# EAGLE schematic Radio-86RK-SRAM (EAGLE 6.3)

## Sheet 1 of 8
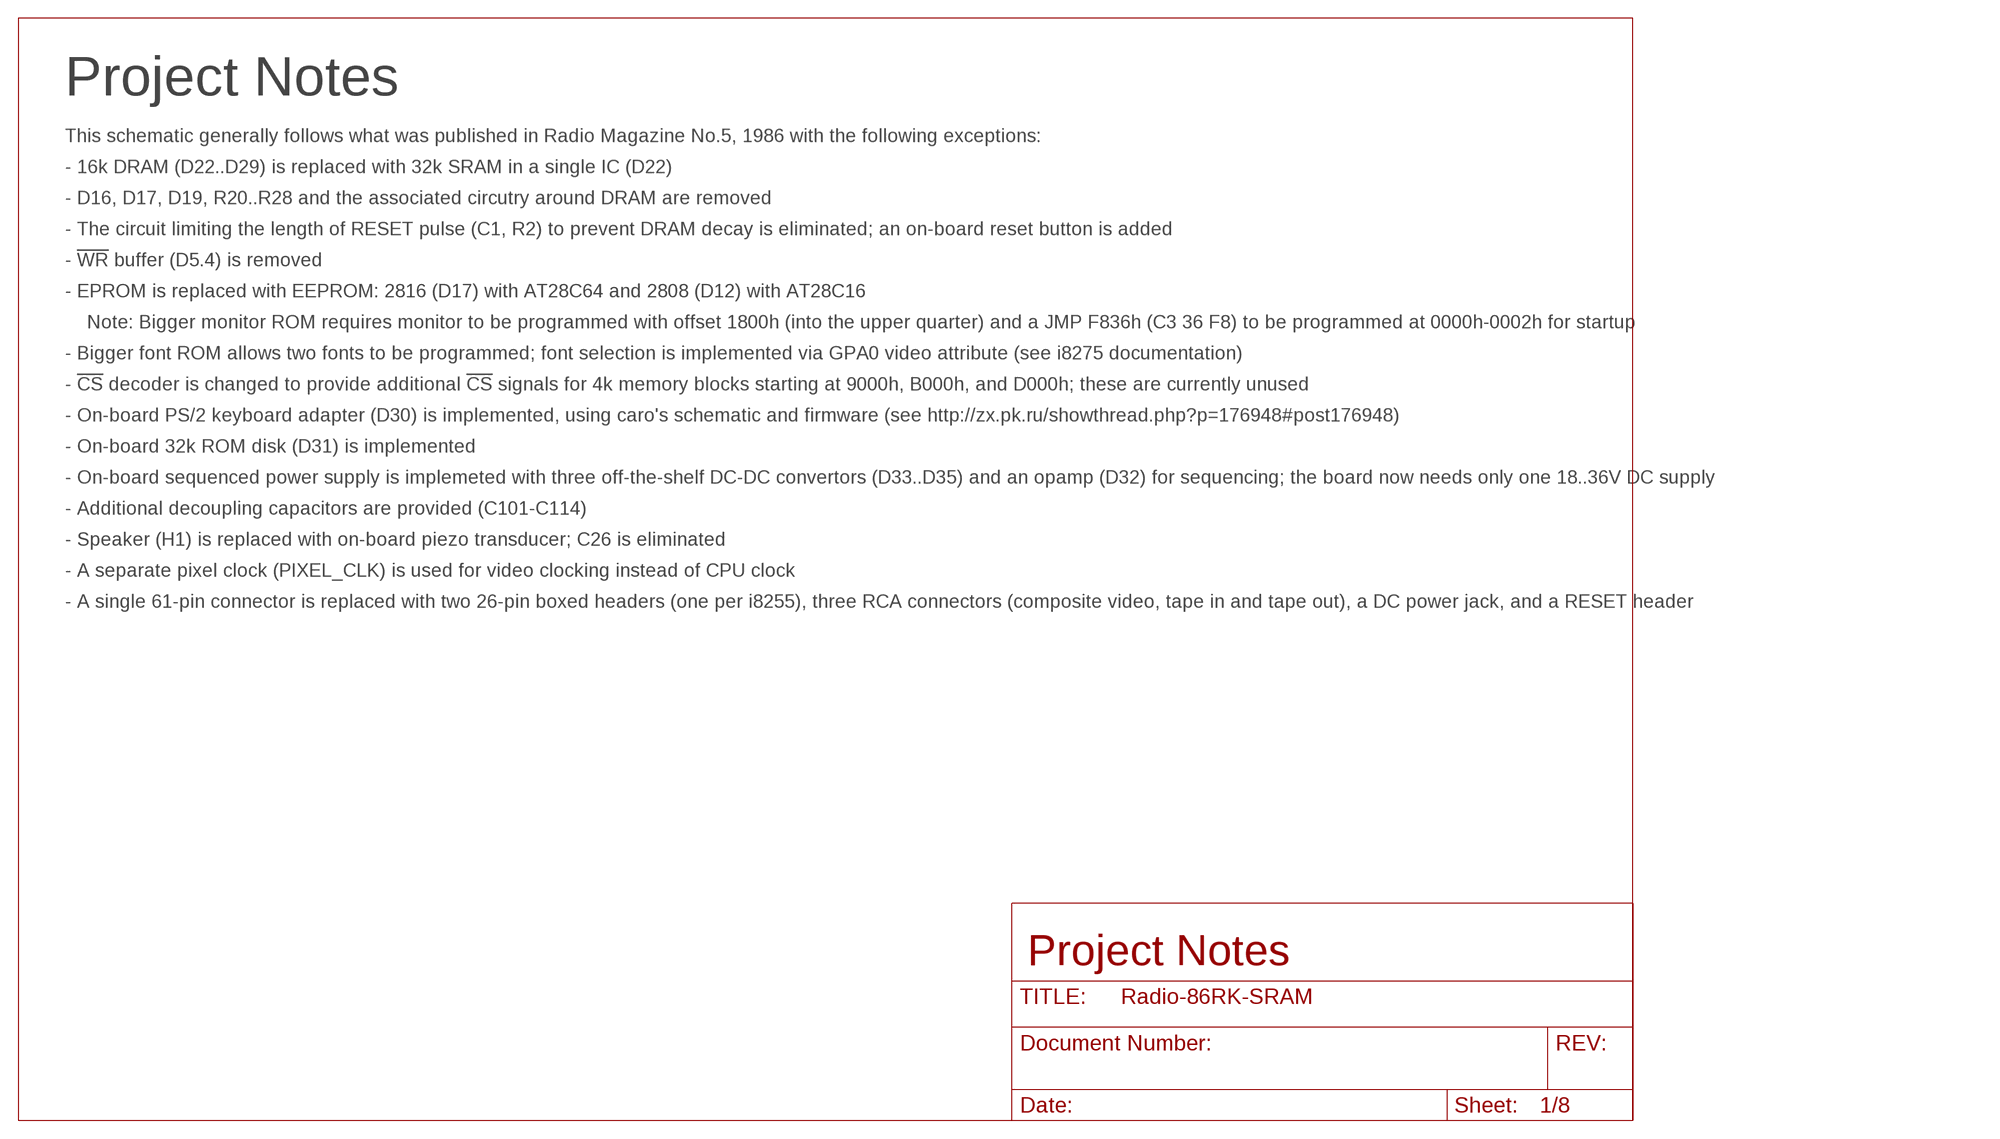
[diagram p0: schematic, sheet 1]

### Notes on the sheet
- Project Notes
- This schematic generally follows what was published in Radio Magazine No.5, 1986 with the following exceptions:
- - 16k DRAM (D22..D29) is replaced with 32k SRAM in a single IC (D22)
- - D16, D17, D19, R20..R28 and the associated circutry around DRAM are removed
- - The circuit limiting the length of RESET pulse (C1, R2) to prevent DRAM decay is eliminated; an on-board reset button is added
- - !WR! buffer (D5.4) is removed
- - EPROM is replaced with EEPROM: 2816 (D17) with AT28C64 and 2808 (D12) with AT28C16
- Note: Bigger monitor ROM requires monitor to be programmed with offset 1800h (into the upper quarter) and a JMP F836h (C3 36 F8) to be programmed at 0000h-0002h for startup
- - Bigger font ROM allows two fonts to be programmed; font selection is implemented via GPA0 video attribute (see i8275 documentation)
- - !CS! decoder is changed to provide additional !CS! signals for 4k memory blocks starting at 9000h, B000h, and D000h; these are currently unused
- - On-board PS/2 keyboard adapter (D30) is implemented, using caro's schematic and firmware (see http://zx.pk.ru/showthread.php?p=176948#post176948)
- - On-board 32k ROM disk (D31) is implemented
- - On-board sequenced power supply is implemeted with three off-the-shelf DC-DC convertors (D33..D35) and an opamp (D32) for sequencing; the board now needs only one 18..36V DC supply
- - Additional decoupling capacitors are provided (C101-C114)
- - Speaker (H1) is replaced with on-board piezo transducer; C26 is eliminated
- - A separate pixel clock (PIXEL_CLK) is used for video clocking instead of CPU clock
- - A single 61-pin connector is replaced with two 26-pin boxed headers (one per i8255), three RCA connectors (composite video, tape in and tape out), a DC power jack, and a RESET header
- Project Notes

## Sheet 2 of 8
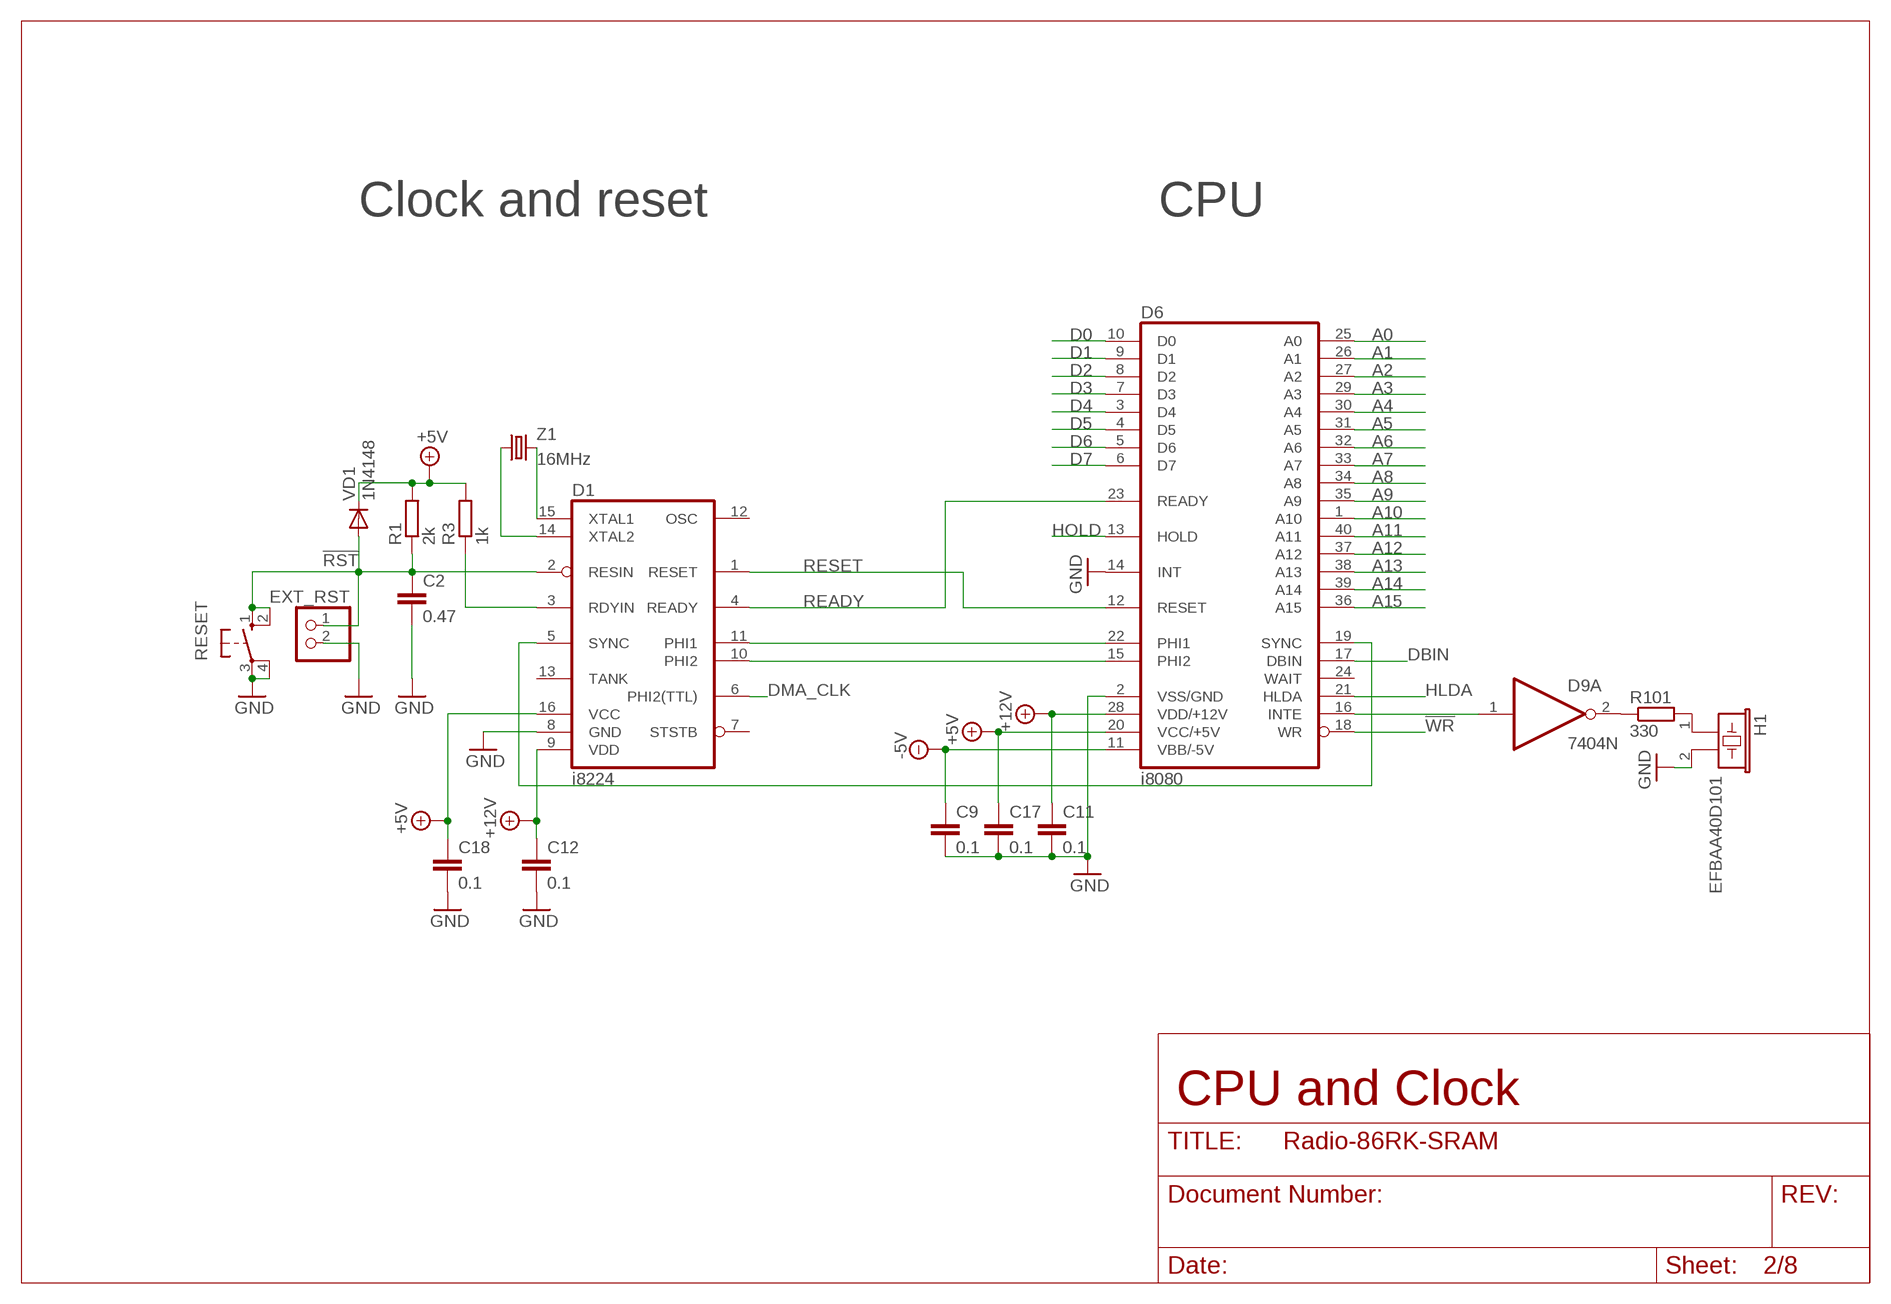
[diagram p1: schematic, sheet 2]

### Parts
C2  0.47  C-EU050-024X044  [C050-024X044]
C9  0.1  C-EU050-024X044  [C050-024X044]
C11  0.1  C-EU050-024X044  [C050-024X044]
C12  0.1  C-EU050-024X044  [C050-024X044]
C17  0.1  C-EU050-024X044  [C050-024X044]
C18  0.1  C-EU050-024X044  [C050-024X044]
D1  i8224  8224  [DIL16]
D6  i8080  8080  [DIL40]
D9  7404N  [DIL14]
EXT_RST  PINHD-1X2  [1X02]
H1  EFBAA40D101  [EFBAA40D101]
R1  2k  R-EU_0207/10  [0207/10]
R3  1k  R-EU_0207/10  [0207/10]
R101  330  R-EU_0207/10  [0207/10]
RESET  10-XX  [B3F-10XX]
VD1  1N4148  1N4148DO35-10  [DO35-10]
Z1  16MHz  CRYSTALHC49U-V  [HC49U-V]

### Nets
!RST: C2.1 D1.2(RESIN) EXT_RST.1 R1.1 RESET.1(S) RESET.2(S1) VD1.A ; also sheet 5
!WR: D6.18(WR) ; also sheet 3,4,7
+5V [power]: C17.1 C18.1 D1.16(VCC) D6.20(VCC/+5V) R1.2 R3.2 VD1.C ; also sheet 3,4,5,6,7,8
+12V [power]: C11.1 C12.1 D1.9(VDD) D6.28(VDD/+12V) ; also sheet 6
-5V [power]: C9.1 D6.11(VBB/-5V) ; also sheet 4,6
A0: D6.25(A0) ; also sheet 3,4,7
A1: D6.26(A1) ; also sheet 4,7
A2: D6.27(A2) ; also sheet 7
A3: D6.29(A3) ; also sheet 7
A4: D6.30(A4) ; also sheet 7
A5: D6.31(A5) ; also sheet 7
A6: D6.32(A6) ; also sheet 7
A7: D6.33(A7) ; also sheet 7
A8: D6.34(A8) ; also sheet 7
A9: D6.35(A9) ; also sheet 7
A10: D6.1(A10) ; also sheet 7
A11: D6.40(A11) ; also sheet 7
A12: D6.37(A12) ; also sheet 7,8
A13: D6.38(A13) ; also sheet 7,8
A14: D6.39(A14) ; also sheet 7,8
A15: D6.36(A15) ; also sheet 7,8
D0: D6.10(D0) ; also sheet 3,4,7
D1: D6.9(D1) ; also sheet 3,4,7
D2: D6.8(D2) ; also sheet 3,4,7
D3: D6.7(D3) ; also sheet 3,4,7
D4: D6.3(D4) ; also sheet 3,4,7
D5: D6.4(D5) ; also sheet 3,4,7
D6: D6.5(D6) ; also sheet 3,4,7
D7: D6.6(D7) ; also sheet 3,4,7
DBIN: D6.17(DBIN) ; also sheet 7,8
DMA_CLK: D1.6(PHI2(TTL)) ; also sheet 7
GND [power]: C2.2 C9.2 C11.2 C12.2 C17.2 C18.2 D1.8(GND) D6.2(VSS/GND) D6.14(INT) EXT_RST.2 H1.2 RESET.3(P) RESET.4(P1) ; also sheet 3,4,5,6,7,8
HLDA: D6.21(HLDA) ; also sheet 7
HOLD: D6.13(HOLD) ; also sheet 7
N$1: D1.11(PHI1) D6.22(PHI1)
N$2: D1.10(PHI2) D6.15(PHI2)
N$3: D1.15(XTAL1) Z1.2
N$4: D1.14(XTAL2) Z1.1
N$5: D1.5(SYNC) D6.19(SYNC)
N$7: D1.3(RDYIN) R3.1
N$11: D6.16(INTE) D9.1(A:I)
N$12: H1.1 R101.2
N$16: D9.2(A:O) R101.1
READY: D1.4(READY) D6.23(READY) ; also sheet 7
RESET: D1.1(RESET) D6.12(RESET) ; also sheet 4,7,8
Unconnected: D1.7(STSTB) D1.12(OSC) D1.13(TANK) D6.24(WAIT)

### Notes on the sheet
- Clock and reset | CPU
- CPU and Clock

## Sheet 3 of 8
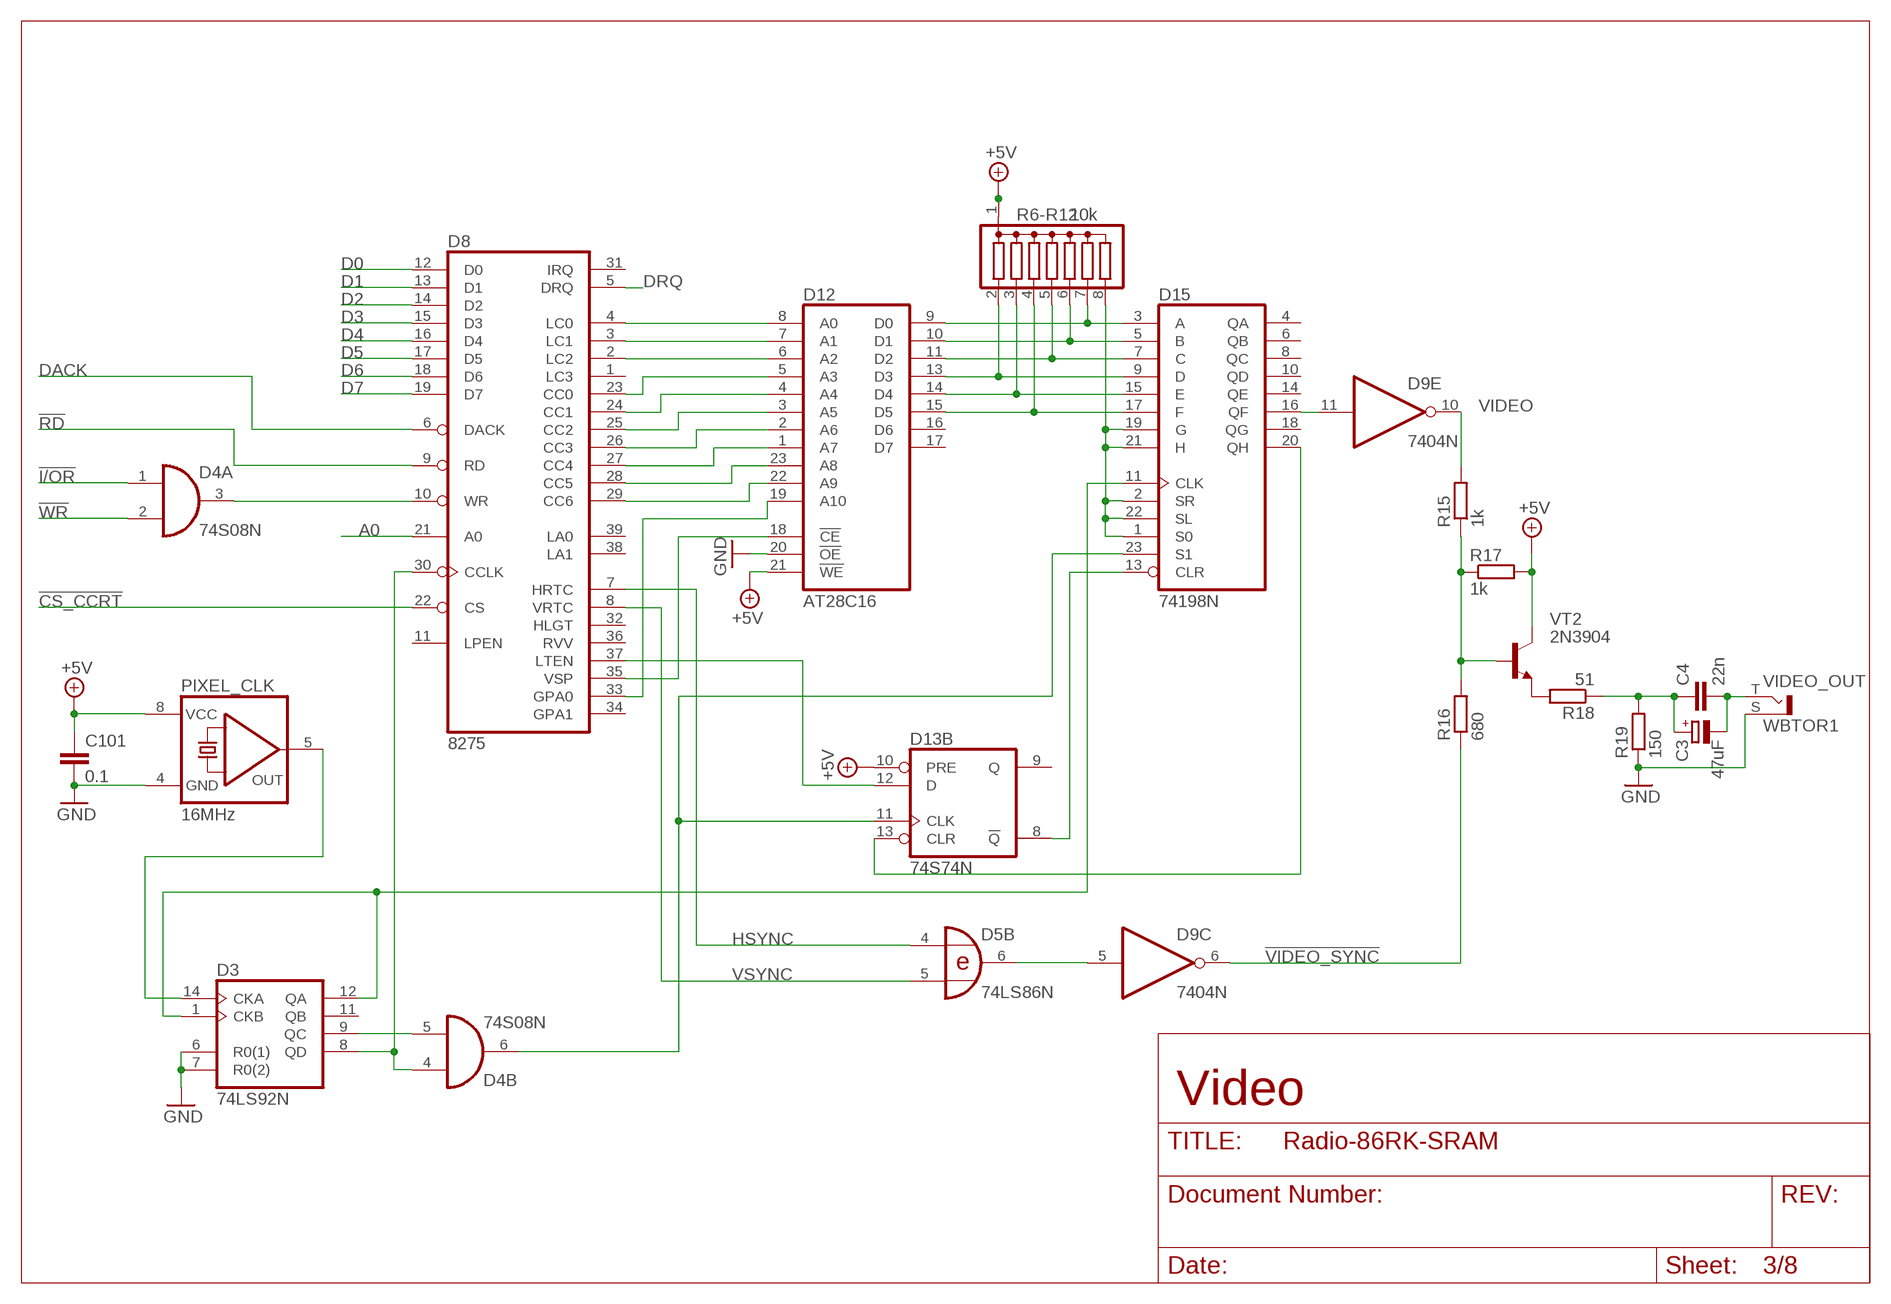
[diagram p2: schematic, sheet 3]

### Parts
C3  47uF  CPOL-EUE2.5-5  [E2,5-5]
C4  22n  C-EU050-024X044  [C050-024X044]
C101  0.1  C-EU050-024X044  [C050-024X044]
D3  74LS92N  [DIL14]
D4  74S08N  [DIL14]
D5  74LS86N  74AC86N  [DIL14]
D8  8275  [DIL40]
D12  AT28C16  2816  [DIL24]
D13  74S74N  [DIL14]
D15  74198N  [DIL24-6]
PIXEL_CLK  16MHz  QG5460  [DIL08S]
R6-R12  10k  G07R  [SIL8]
R15  1k  R-EU_0207/10  [0207/10]
R16  680  R-EU_0207/10  [0207/10]
R17  1k  R-EU_0207/10  [0207/10]
R18  51  R-EU_0207/10  [0207/10]
R19  150  R-EU_0207/10  [0207/10]
VIDEO_OUT  WBTOR1  [WBTOR1]
VT2  2N3904  [TO92]

### Nets
!CS_CCRT: D8.22(CS) ; also sheet 8
!I/OR: D4.1(A:I0) ; also sheet 7,8
!RD: D8.9(RD) ; also sheet 4,7
!VIDEO: D9.11(E:I) D15.16(QF)
!VIDEO_SYNC: D9.6(C:O) R16.1
!WR: D4.2(A:I1) ; also sheet 2,4,7
+5V [power]: C101.1 D12.21(!WE) D13.10(B:PRE) PIXEL_CLK.8(VCC) R6-R12.1 R17.2 VT2.1(C) ; also sheet 2,4,5,6,7,8
A0: D8.21(A0) ; also sheet 2,4,7
COMPOSITE_VIDEO: C3.- C4.2 VIDEO_OUT.T
D0: D8.12(D0) ; also sheet 2,4,7
D1: D8.13(D1) ; also sheet 2,4,7
D2: D8.14(D2) ; also sheet 2,4,7
D3: D8.15(D3) ; also sheet 2,4,7
D4: D8.16(D4) ; also sheet 2,4,7
D5: D8.17(D5) ; also sheet 2,4,7
D6: D8.18(D6) ; also sheet 2,4,7
D7: D8.19(D7) ; also sheet 2,4,7
DACK: D8.6(DACK) ; also sheet 7
DRQ: D8.5(DRQ) ; also sheet 7
GND [power]: C101.2 D3.6(R0(1)) D3.7(R0(2)) D12.20(!OE) PIXEL_CLK.4(GND) R19.1 VIDEO_OUT.S ; also sheet 2,4,5,6,7,8
HSYNC: D5.4(B:I0) D8.7(HRTC)
N$30: D3.14(CKA) PIXEL_CLK.5(OUT)
N$31: D3.1(CKB) D3.12(QA) D15.11(CLK)
N$32: D4.3(A:O) D8.10(WR)
N$33: D3.9(QC) D4.5(B:I1)
N$34: D3.8(QD) D4.4(B:I0) D8.30(CCLK)
N$35: D8.23(CC0) D12.5(A3)
N$36: D8.24(CC1) D12.4(A4)
N$37: D8.25(CC2) D12.3(A5)
N$38: D8.26(CC3) D12.2(A6)
N$39: D8.27(CC4) D12.1(A7)
N$40: D8.4(LC0) D12.8(A0)
N$41: D8.3(LC1) D12.7(A1)
N$42: D8.2(LC2) D12.6(A2)
N$43: D8.35(VSP) D12.18(!CE)
N$44: D12.9(D0) D15.3(A) R6-R12.7
N$45: D8.28(CC5) D12.23(A8)
N$46: D8.29(CC6) D12.22(A9)
N$47: D12.10(D1) D15.5(B) R6-R12.6
N$48: D12.11(D2) D15.7(C) R6-R12.5
N$49: D12.13(D3) D15.9(D) R6-R12.2
N$50: D12.14(D4) D15.15(E) R6-R12.3
N$51: D12.15(D5) D15.17(F) R6-R12.4
N$53: D13.13(B:CLR) D15.20(QH)
N$54: D13.8(B:!Q) D15.13(CLR)
N$55: D4.6(B:O) D13.11(B:CLK) D15.23(S1)
N$56: D8.37(LTEN) D13.12(B:D)
N$57: R15.1 R16.2 R17.1 VT2.2(B)
N$60: D5.6(B:O) D9.5(C:I)
N$63: R18.2 VT2.3(E)
N$64: C3.+ C4.1 R18.1 R19.2
N$105: D8.33(GPA0) D12.19(A10)
N$109 [power]: D15.1(S0) D15.2(SR) D15.19(G) D15.21(H) D15.22(SL) R6-R12.8
VIDEO: D9.10(E:O) R15.2
VSYNC: D5.5(B:I1) D8.8(VRTC)
Unconnected: D3.11(QB) D8.1(LC3) D8.11(LPEN) D8.31(IRQ) D8.32(HLGT) D8.34(GPA1) D8.36(RVV) D8.38(LA1) D8.39(LA0) D12.16(D6) D12.17(D7) D13.9(B:Q) D15.4(QA) D15.6(QB) D15.8(QC) D15.10(QD) D15.14(QE) D15.18(QG)

### Notes on the sheet
- Video

## Sheet 4 of 8
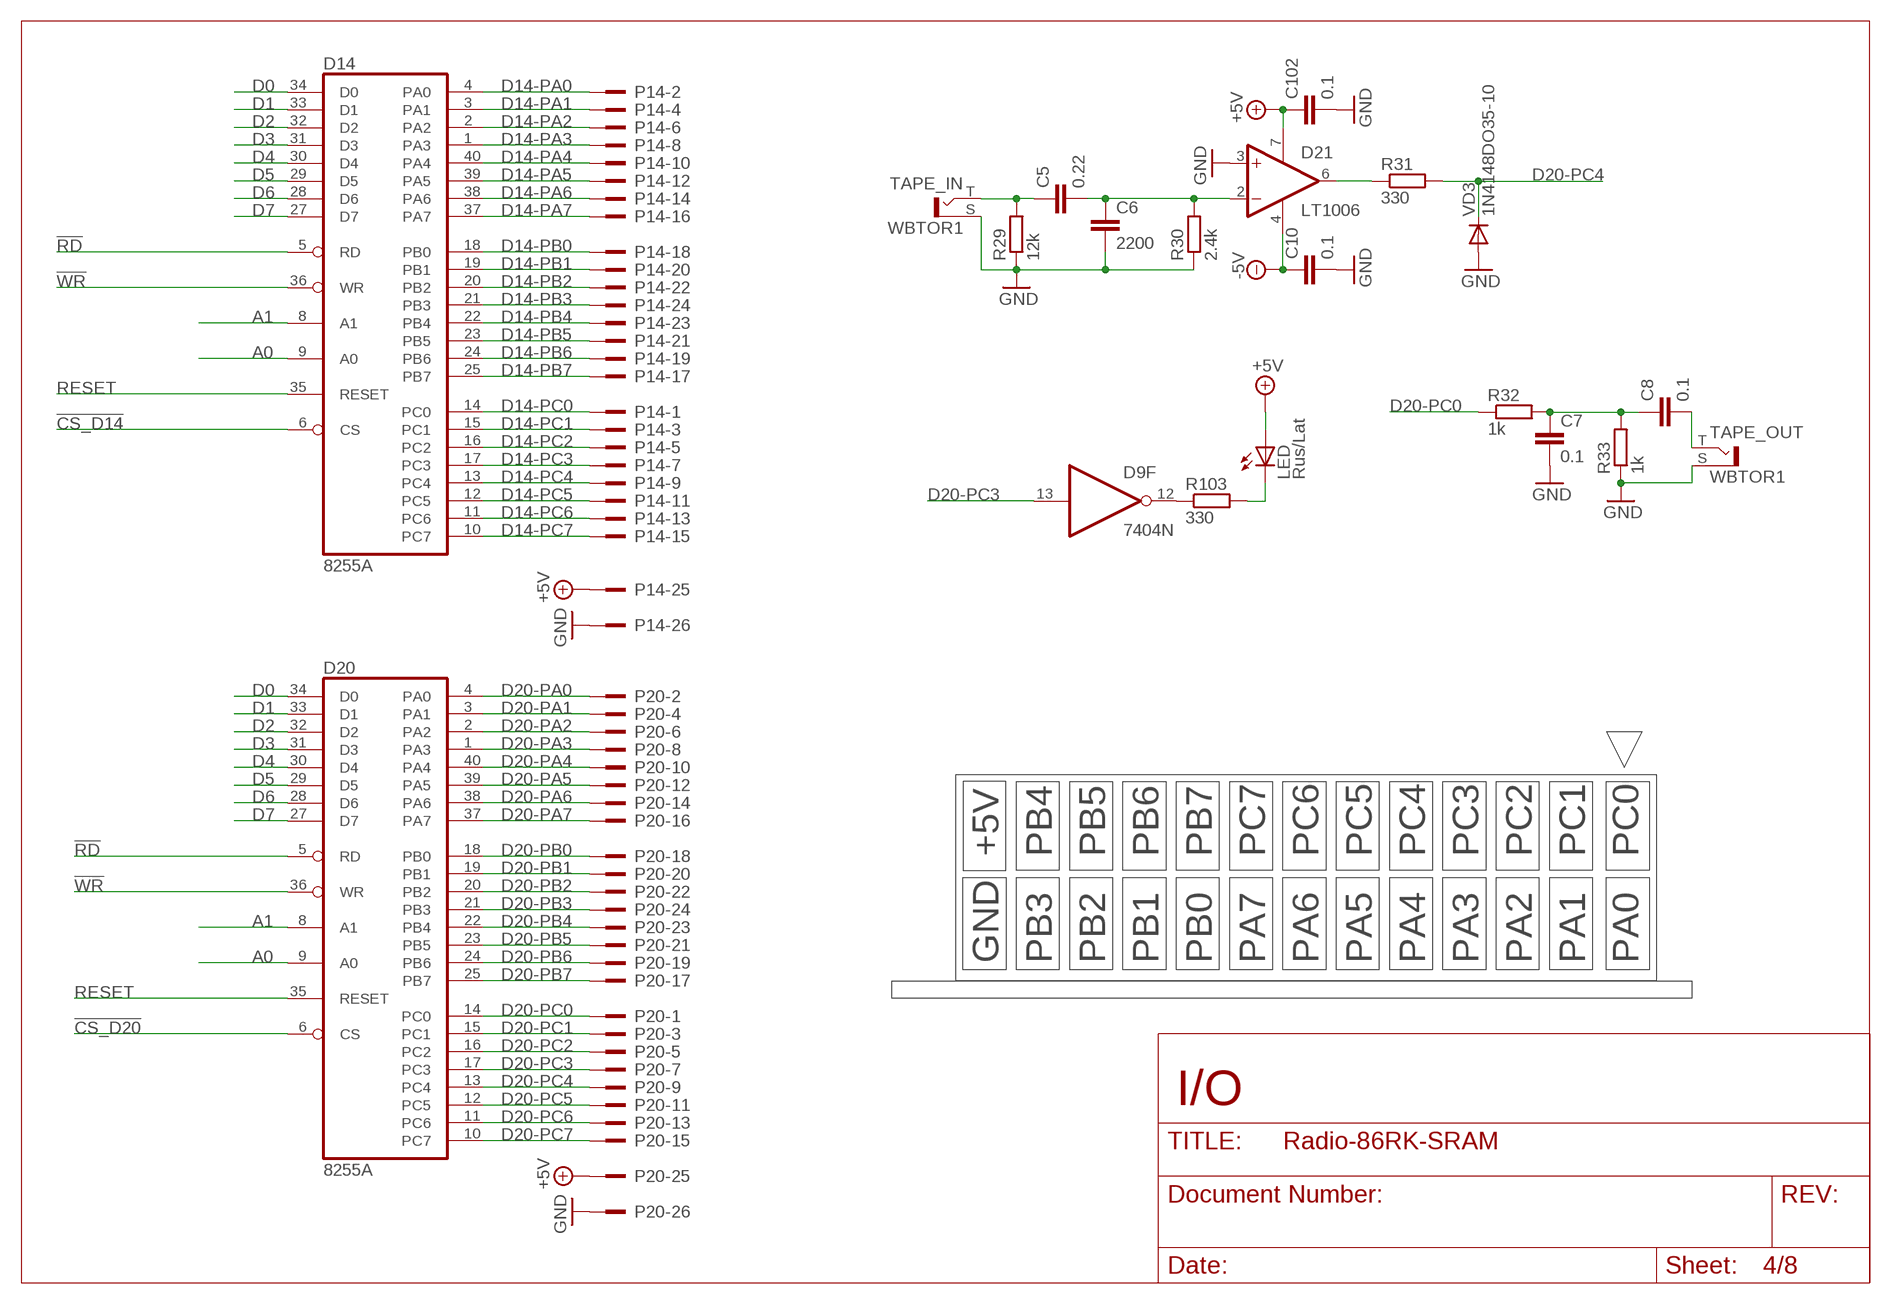
[diagram p3: schematic, sheet 4]

### Parts
C5  0.22  C-EU050-024X044  [C050-024X044]
C6  2200  C-EU050-024X044  [C050-024X044]
C7  0.1  C-EU050-024X044  [C050-024X044]
C8  0.1  C-EU050-024X044  [C050-024X044]
C10  0.1  C-EU050-024X044  [C050-024X044]
C102  0.1  C-EU050-024X044  [C050-024X044]
D14  8255A  [DIL40]
D20  8255A  [DIL40]
D21  LT1006  1AMP_P7+4N  [DIL08]
LED  Rus/Lat  LED3MM  [LED3MM]
P14  2526-5  [PAK100/2500-5-26]
P20  2526-5  [PAK100/2500-5-26]
R29  12k  R-EU_0207/10  [0207/10]
R30  2.4k  R-EU_0207/10  [0207/10]
R31  330  R-EU_0207/10  [0207/10]
R32  1k  R-EU_0207/10  [0207/10]
R33  1k  R-EU_0207/10  [0207/10]
R103  330  R-EU_0207/10  [0207/10]
TAPE_IN  WBTOR1  [WBTOR1]
TAPE_OUT  WBTOR1  [WBTOR1]
VD3  1N4148DO35-10  [DO35-10]

### Nets
!CS_D14: D14.6(CS) ; also sheet 8
!CS_D20: D20.6(CS) ; also sheet 8
!RD: D14.5(RD) D20.5(RD) ; also sheet 3,7
!WR: D14.36(WR) D20.36(WR) ; also sheet 2,3,7
+5V [power]: C102.1 D21.7(V+) LED.A P14.25 P20.25 ; also sheet 2,3,5,6,7,8
-5V [power]: C10.1 D21.4(V-) ; also sheet 2,6
A0: D14.9(A0) D20.9(A0) ; also sheet 2,3,7
A1: D14.8(A1) D20.8(A1) ; also sheet 2,7
D0: D14.34(D0) D20.34(D0) ; also sheet 2,3,7
D1: D14.33(D1) D20.33(D1) ; also sheet 2,3,7
D2: D14.32(D2) D20.32(D2) ; also sheet 2,3,7
D3: D14.31(D3) D20.31(D3) ; also sheet 2,3,7
D4: D14.30(D4) D20.30(D4) ; also sheet 2,3,7
D5: D14.29(D5) D20.29(D5) ; also sheet 2,3,7
D6: D14.28(D6) D20.28(D6) ; also sheet 2,3,7
D7: D14.27(D7) D20.27(D7) ; also sheet 2,3,7
D14-PA0: D14.4(PA0) P14.2 ; also sheet 5
D14-PA1: D14.3(PA1) P14.4 ; also sheet 5
D14-PA2: D14.2(PA2) P14.6 ; also sheet 5
D14-PA3: D14.1(PA3) P14.8 ; also sheet 5
D14-PA4: D14.40(PA4) P14.10 ; also sheet 5
D14-PA5: D14.39(PA5) P14.12 ; also sheet 5
D14-PA6: D14.38(PA6) P14.14 ; also sheet 5
D14-PA7: D14.37(PA7) P14.16 ; also sheet 5
D14-PB0: D14.18(PB0) P14.18 ; also sheet 5
D14-PB1: D14.19(PB1) P14.20 ; also sheet 5
D14-PB2: D14.20(PB2) P14.22 ; also sheet 5
D14-PB3: D14.21(PB3) P14.24 ; also sheet 5
D14-PB4: D14.22(PB4) P14.23 ; also sheet 5
D14-PB5: D14.23(PB5) P14.21 ; also sheet 5
D14-PB6: D14.24(PB6) P14.19 ; also sheet 5
D14-PB7: D14.25(PB7) P14.17 ; also sheet 5
D14-PC0: D14.14(PC0) P14.1 ; also sheet 5
D14-PC1: D14.15(PC1) P14.3 ; also sheet 5
D14-PC2: D14.16(PC2) P14.5 ; also sheet 5
D14-PC3: D14.17(PC3) P14.7 ; also sheet 5
D14-PC4: D14.13(PC4) P14.9 ; also sheet 5
D14-PC5: D14.12(PC5) P14.11 ; also sheet 5
D14-PC6: D14.11(PC6) P14.13 ; also sheet 5
D14-PC7: D14.10(PC7) P14.15 ; also sheet 5
D20-PA0: D20.4(PA0) P20.2 ; also sheet 5
D20-PA1: D20.3(PA1) P20.4 ; also sheet 5
D20-PA2: D20.2(PA2) P20.6 ; also sheet 5
D20-PA3: D20.1(PA3) P20.8 ; also sheet 5
D20-PA4: D20.40(PA4) P20.10 ; also sheet 5
D20-PA5: D20.39(PA5) P20.12 ; also sheet 5
D20-PA6: D20.38(PA6) P20.14 ; also sheet 5
D20-PA7: D20.37(PA7) P20.16 ; also sheet 5
D20-PB0: D20.18(PB0) P20.18 ; also sheet 5
D20-PB1: D20.19(PB1) P20.20 ; also sheet 5
D20-PB2: D20.20(PB2) P20.22 ; also sheet 5
D20-PB3: D20.21(PB3) P20.24 ; also sheet 5
D20-PB4: D20.22(PB4) P20.23 ; also sheet 5
D20-PB5: D20.23(PB5) P20.21 ; also sheet 5
D20-PB6: D20.24(PB6) P20.19 ; also sheet 5
D20-PB7: D20.25(PB7) P20.17 ; also sheet 5
D20-PC0: D20.14(PC0) P20.1 R32.1
D20-PC1: D20.15(PC1) P20.3
D20-PC2: D20.16(PC2) P20.5
D20-PC3: D9.13(F:I) D20.17(PC3) P20.7
D20-PC4: D20.13(PC4) P20.9 R31.2 VD3.C
D20-PC5: D20.12(PC5) P20.11 ; also sheet 5
D20-PC6: D20.11(PC6) P20.13 ; also sheet 5
D20-PC7: D20.10(PC7) P20.15 ; also sheet 5
GND [power]: C6.2 C7.2 C10.2 C102.2 D21.3(+IN) P14.26 P20.26 R29.1 R30.1 R33.1 TAPE_IN.S TAPE_OUT.S VD3.A ; also sheet 2,3,5,6,7,8
N$10: D9.12(F:O) R103.1
N$27: LED.K(C) R103.2
N$62: C5.2 C6.1 D21.2(-IN) R30.2
N$110: C7.1 C8.1 R32.2 R33.2
N$111: D21.6(OUT) R31.1
N$113: C5.1 R29.2 TAPE_IN.T
N$123: C8.2 TAPE_OUT.T
RESET: D14.35(RESET) D20.35(RESET) ; also sheet 2,7,8

### Notes on the sheet
- +5V | PB4 | PB5 | PB6 | PB7 | PC7 | PC6 | PC5 | PC4 | PC3 | PC2 | PC1 | PC0
- GND | PB3 | PB2 | PB1 | PB0 | PA7 | PA6 | PA5 | PA4 | PA3 | PA2 | PA1 | PA0
- I/O

## Sheet 5 of 8
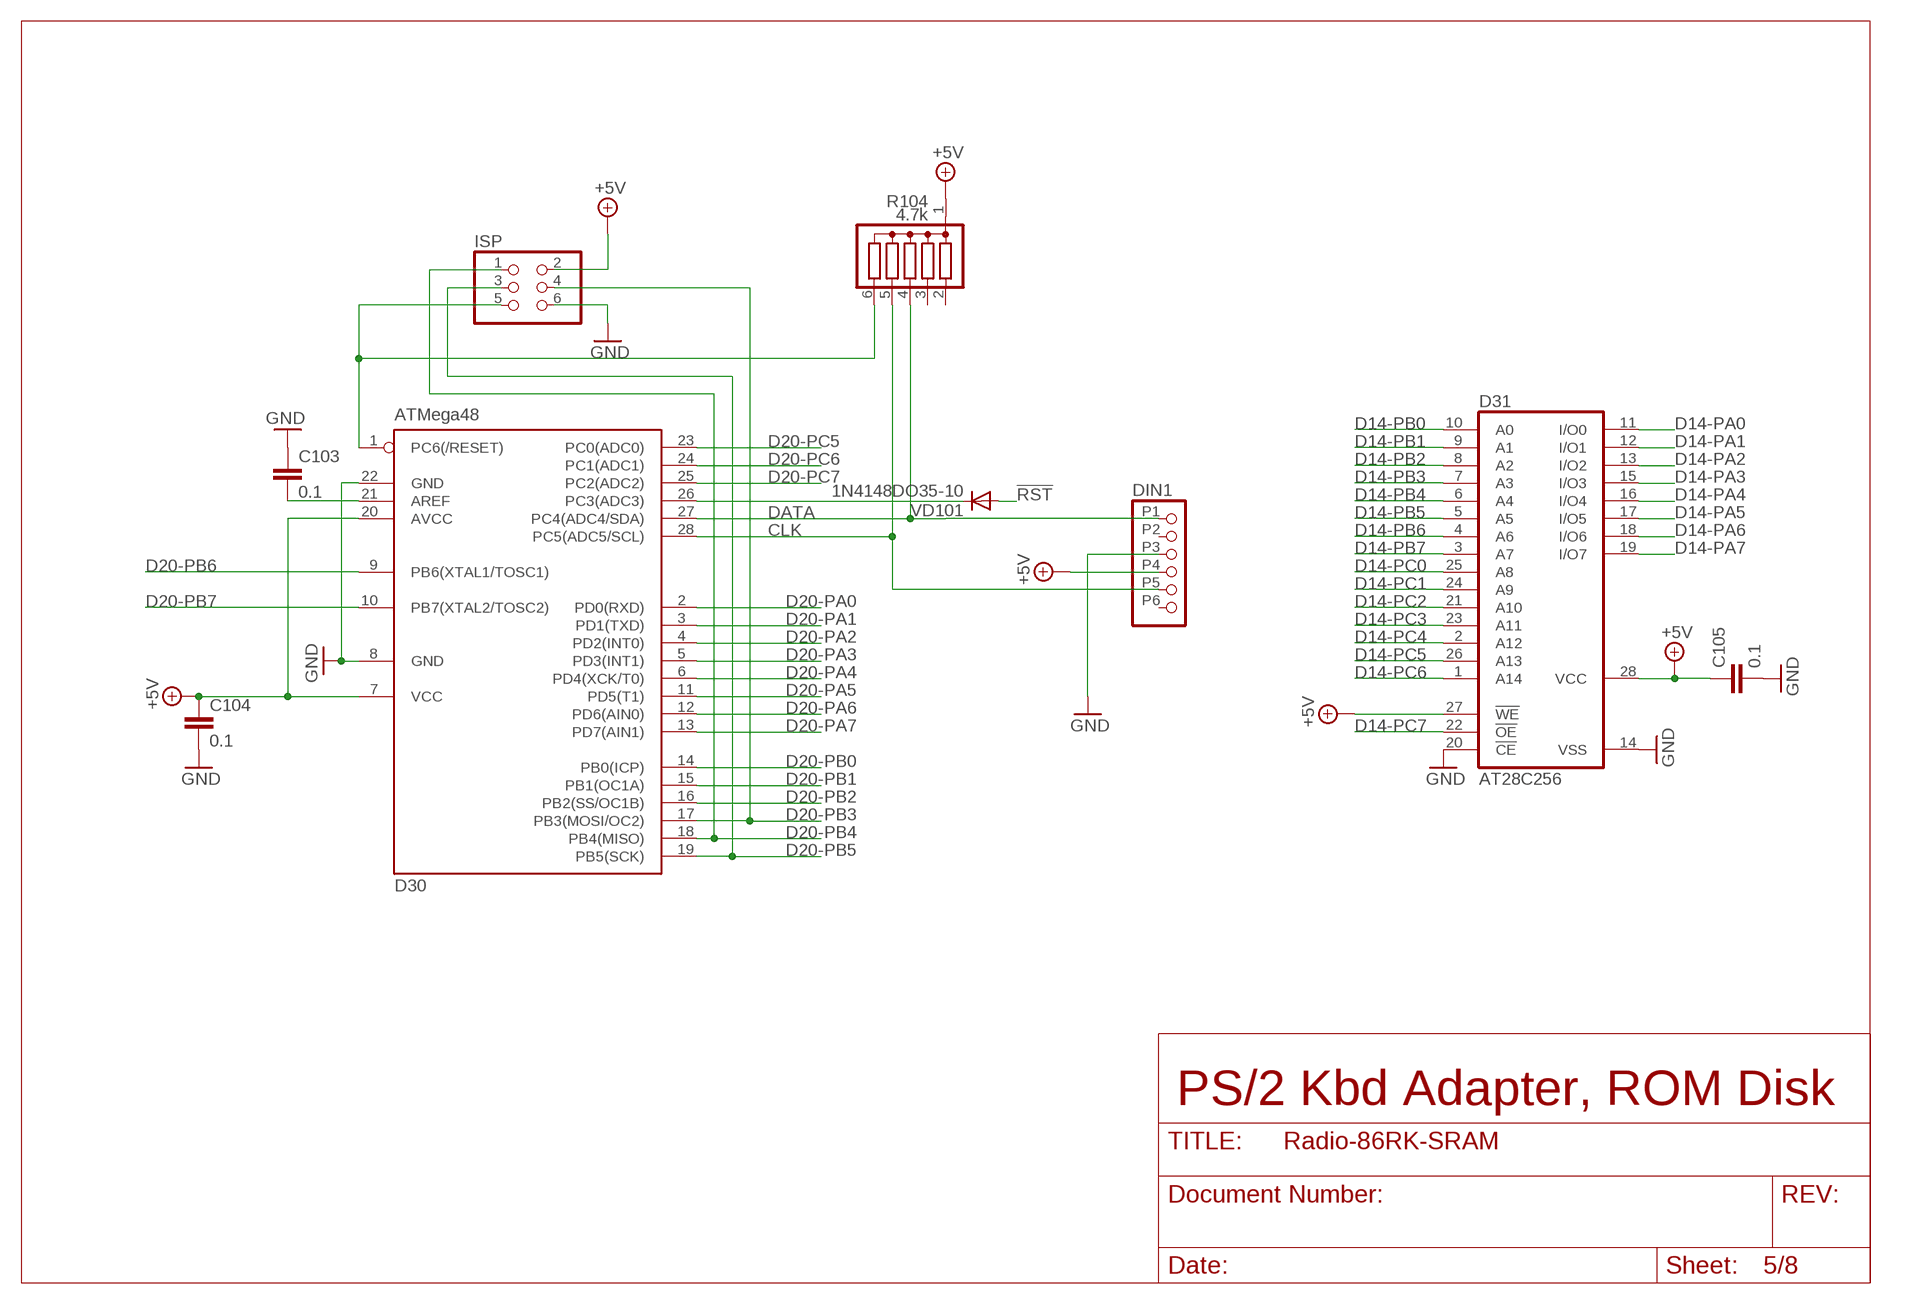
[diagram p4: schematic, sheet 5]

### Parts
C103  0.1  C-EU050-024X044  [C050-024X044]
C104  0.1  C-EU050-024X044  [C050-024X044]
C105  0.1  C-EU050-024X044  [C050-024X044]
D30  ATMega48  MEGA8-P  [DIL28-3]
D31  AT28C256  58C256P  [DIL28-6]
DIN1  TM0508A/6  [MINI-DIN6]
ISP  PINHD-2X3  [2X03]
R104  4.7k  G05R  [SIL6]
VD101  1N4148DO35-10  [DO35-10]

### Nets
!RST: VD101.A ; also sheet 2
+5V [power]: C104.1 C105.1 D30.7(VCC) D30.20(AVCC) D31.27(!WE) D31.28(VCC) DIN1.P4 ISP.2 R104.1 ; also sheet 2,3,4,6,7,8
CLK: D30.28(PC5(ADC5/SCL)) DIN1.P5 R104.5
D14-PA0: D31.11(I/O0) ; also sheet 4
D14-PA1: D31.12(I/O1) ; also sheet 4
D14-PA2: D31.13(I/O2) ; also sheet 4
D14-PA3: D31.15(I/O3) ; also sheet 4
D14-PA4: D31.16(I/O4) ; also sheet 4
D14-PA5: D31.17(I/O5) ; also sheet 4
D14-PA6: D31.18(I/O6) ; also sheet 4
D14-PA7: D31.19(I/O7) ; also sheet 4
D14-PB0: D31.10(A0) ; also sheet 4
D14-PB1: D31.9(A1) ; also sheet 4
D14-PB2: D31.8(A2) ; also sheet 4
D14-PB3: D31.7(A3) ; also sheet 4
D14-PB4: D31.6(A4) ; also sheet 4
D14-PB5: D31.5(A5) ; also sheet 4
D14-PB6: D31.4(A6) ; also sheet 4
D14-PB7: D31.3(A7) ; also sheet 4
D14-PC0: D31.25(A8) ; also sheet 4
D14-PC1: D31.24(A9) ; also sheet 4
D14-PC2: D31.21(A10) ; also sheet 4
D14-PC3: D31.23(A11) ; also sheet 4
D14-PC4: D31.2(A12) ; also sheet 4
D14-PC5: D31.26(A13) ; also sheet 4
D14-PC6: D31.1(A14) ; also sheet 4
D14-PC7: D31.22(!OE) ; also sheet 4
D20-PA0: D30.2(PD0(RXD)) ; also sheet 4
D20-PA1: D30.3(PD1(TXD)) ; also sheet 4
D20-PA2: D30.4(PD2(INT0)) ; also sheet 4
D20-PA3: D30.5(PD3(INT1)) ; also sheet 4
D20-PA4: D30.6(PD4(XCK/T0)) ; also sheet 4
D20-PA5: D30.11(PD5(T1)) ; also sheet 4
D20-PA6: D30.12(PD6(AIN0)) ; also sheet 4
D20-PA7: D30.13(PD7(AIN1)) ; also sheet 4
D20-PB0: D30.14(PB0(ICP)) ; also sheet 4
D20-PB1: D30.15(PB1(OC1A)) ; also sheet 4
D20-PB2: D30.16(PB2(SS/OC1B)) ; also sheet 4
D20-PB3: D30.17(PB3(MOSI/OC2)) ISP.4 ; also sheet 4
D20-PB4: D30.18(PB4(MISO)) ISP.1 ; also sheet 4
D20-PB5: D30.19(PB5(SCK)) ISP.3 ; also sheet 4
D20-PB6: D30.9(PB6(XTAL1/TOSC1)) ; also sheet 4
D20-PB7: D30.10(PB7(XTAL2/TOSC2)) ; also sheet 4
D20-PC5: D30.23(PC0(ADC0)) ; also sheet 4
D20-PC6: D30.24(PC1(ADC1)) ; also sheet 4
D20-PC7: D30.25(PC2(ADC2)) ; also sheet 4
DATA: D30.27(PC4(ADC4/SDA)) DIN1.P1 R104.4
GND [power]: C103.1 C104.2 C105.2 D30.8(GND) D30.22(GND) D31.14(VSS) D31.20(!CE) DIN1.P3 ISP.6 ; also sheet 2,3,4,6,7,8
N$52 [power]: C103.2 D30.21(AREF)
N$115: D30.1(PC6(/RESET)) ISP.5 R104.6
N$130: D30.26(PC3(ADC3)) VD101.C
Unconnected: DIN1.P2 DIN1.P6 R104.2 R104.3

### Notes on the sheet
- PS/2 Kbd Adapter, ROM Disk

## Sheet 6 of 8
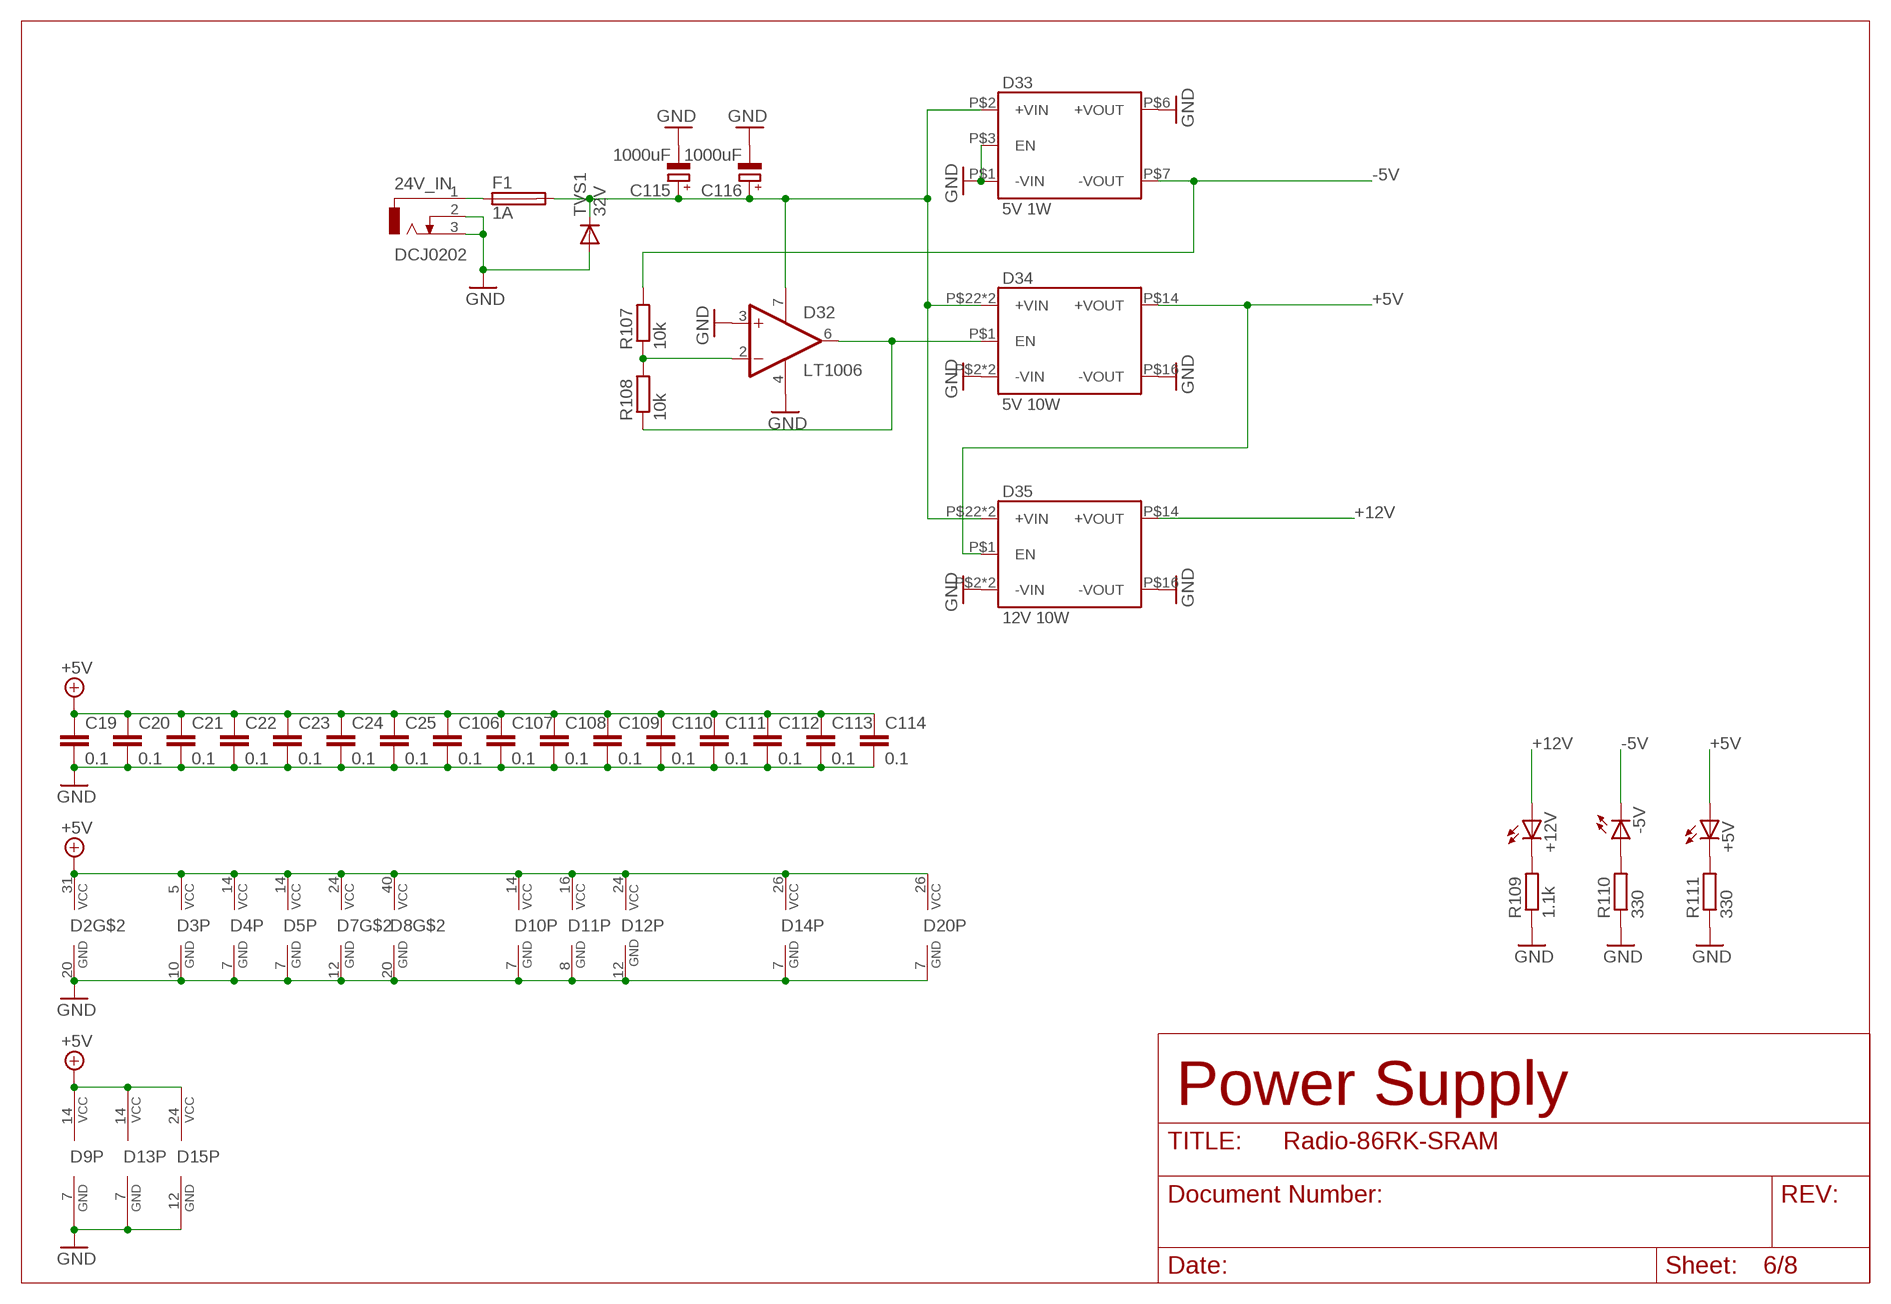
[diagram p5: schematic, sheet 6]

### Parts
24V_IN  DCJ0202  [DCJ0202]
+5V  LED3MM  [LED3MM]
+12V  LED3MM  [LED3MM]
-5V  LED3MM  [LED3MM]
C19  0.1  C-EU050-024X044  [C050-024X044]
C20  0.1  C-EU050-024X044  [C050-024X044]
C21  0.1  C-EU050-024X044  [C050-024X044]
C22  0.1  C-EU050-024X044  [C050-024X044]
C23  0.1  C-EU050-024X044  [C050-024X044]
C24  0.1  C-EU050-024X044  [C050-024X044]
C25  0.1  C-EU050-024X044  [C050-024X044]
C106  0.1  C-EU050-024X044  [C050-024X044]
C107  0.1  C-EU050-024X044  [C050-024X044]
C108  0.1  C-EU050-024X044  [C050-024X044]
C109  0.1  C-EU050-024X044  [C050-024X044]
C110  0.1  C-EU050-024X044  [C050-024X044]
C111  0.1  C-EU050-024X044  [C050-024X044]
C112  0.1  C-EU050-024X044  [C050-024X044]
C113  0.1  C-EU050-024X044  [C050-024X044]
C114  0.1  C-EU050-024X044  [C050-024X044]
C115  1000uF  CPOL-EUE5-13  [E5-13]
C116  1000uF  CPOL-EUE7.5-18  [E7,5-18]
D2  i8257  8257  [DIL40]
D7  8212  [DIL24-6]
D10  74LS00N  74HC00N  [DIL14]
D11  74LS138N  [DIL16]
D32  LT1006  1AMP_P7+4N  [DIL08]
D33  5V 1W  IW_S  [DC/DC_SIP]
D34  5V 10W  JTF_S  [DC/DC_24PIN]
D35  12V 10W  JTF_S  [DC/DC_24PIN]
F1  1A  TE5  [TE5]
R107  10k  R-EU_0207/10  [0207/10]
R108  10k  R-EU_0207/10  [0207/10]
R109  1.1k  R-EU_0207/10  [0207/10]
R110  330  R-EU_0207/10  [0207/10]
R111  330  R-EU_0207/10  [0207/10]
TVS1  32V  DIODE-DO41-10  [DO41-10]

### Nets
+5V [power]: +5V.A C19.1 C20.1 C21.1 C22.1 C23.1 C24.1 C25.1 C106.1 C107.1 C108.1 C109.1 C110.1 C111.1 C112.1 C113.1 C114.1 D2.31(VCC) D3.5(VCC) D4.14(P:VCC) D5.14(P:VCC) D7.24(VCC) D8.40(VCC) D9.14(P:VCC) D10.14(P:VCC) D11.16(VCC) D12.24(VCC) D13.14(P:VCC) D14.26(VCC) D15.24(VCC) D20.26(VCC) D34.P$14(+VOUT) D35.P$1(EN) ; also sheet 2,3,4,5,7,8
+12V [power]: +12V.A D35.P$14(+VOUT) ; also sheet 2
-5V [power]: -5V.K(C) D33.P$7(-VOUT) R107.2 ; also sheet 2,4
GND [power]: 24V_IN.2 24V_IN.3 C19.2 C20.2 C21.2 C22.2 C23.2 C24.2 C25.2 C106.2 C107.2 C108.2 C109.2 C110.2 C111.2 C112.2 C113.2 C114.2 C115.- C116.- D2.20(GND) D3.10(GND) D4.7(P:GND) D5.7(P:GND) D7.12(GND) D8.20(GND) D9.7(P:GND) D10.7(P:GND) D11.8(GND) D12.12(GND) D13.7(P:GND) D14.7(GND) D15.12(GND) D20.7(GND) D32.3(+IN) D32.4(V-) D33.P$1(-VIN) D33.P$3(EN) D33.P$6(+VOUT) D34.P$2(-VIN) D34.P$3(-VIN) D34.P$16(-VOUT) D35.P$2(-VIN) D35.P$3(-VIN) D35.P$16(-VOUT) R109.1 R110.1 R111.1 TVS1.A ; also sheet 2,3,4,5,7,8
N$15: +5V.K(C) R111.2
N$17: +12V.K(C) R109.2
N$18: -5V.A R110.2
N$23 [power]: 24V_IN.1 F1.1
N$28 [power]: C115.+ C116.+ D32.7(V+) D33.P$2(+VIN) D34.P$22(+VIN) D34.P$23(+VIN) D35.P$22(+VIN) D35.P$23(+VIN) F1.2 TVS1.C
N$58: D32.6(OUT) D34.P$1(EN) R108.1
N$59: D32.2(-IN) R107.1 R108.2

### Notes on the sheet
- Power Supply

## Sheet 7 of 8
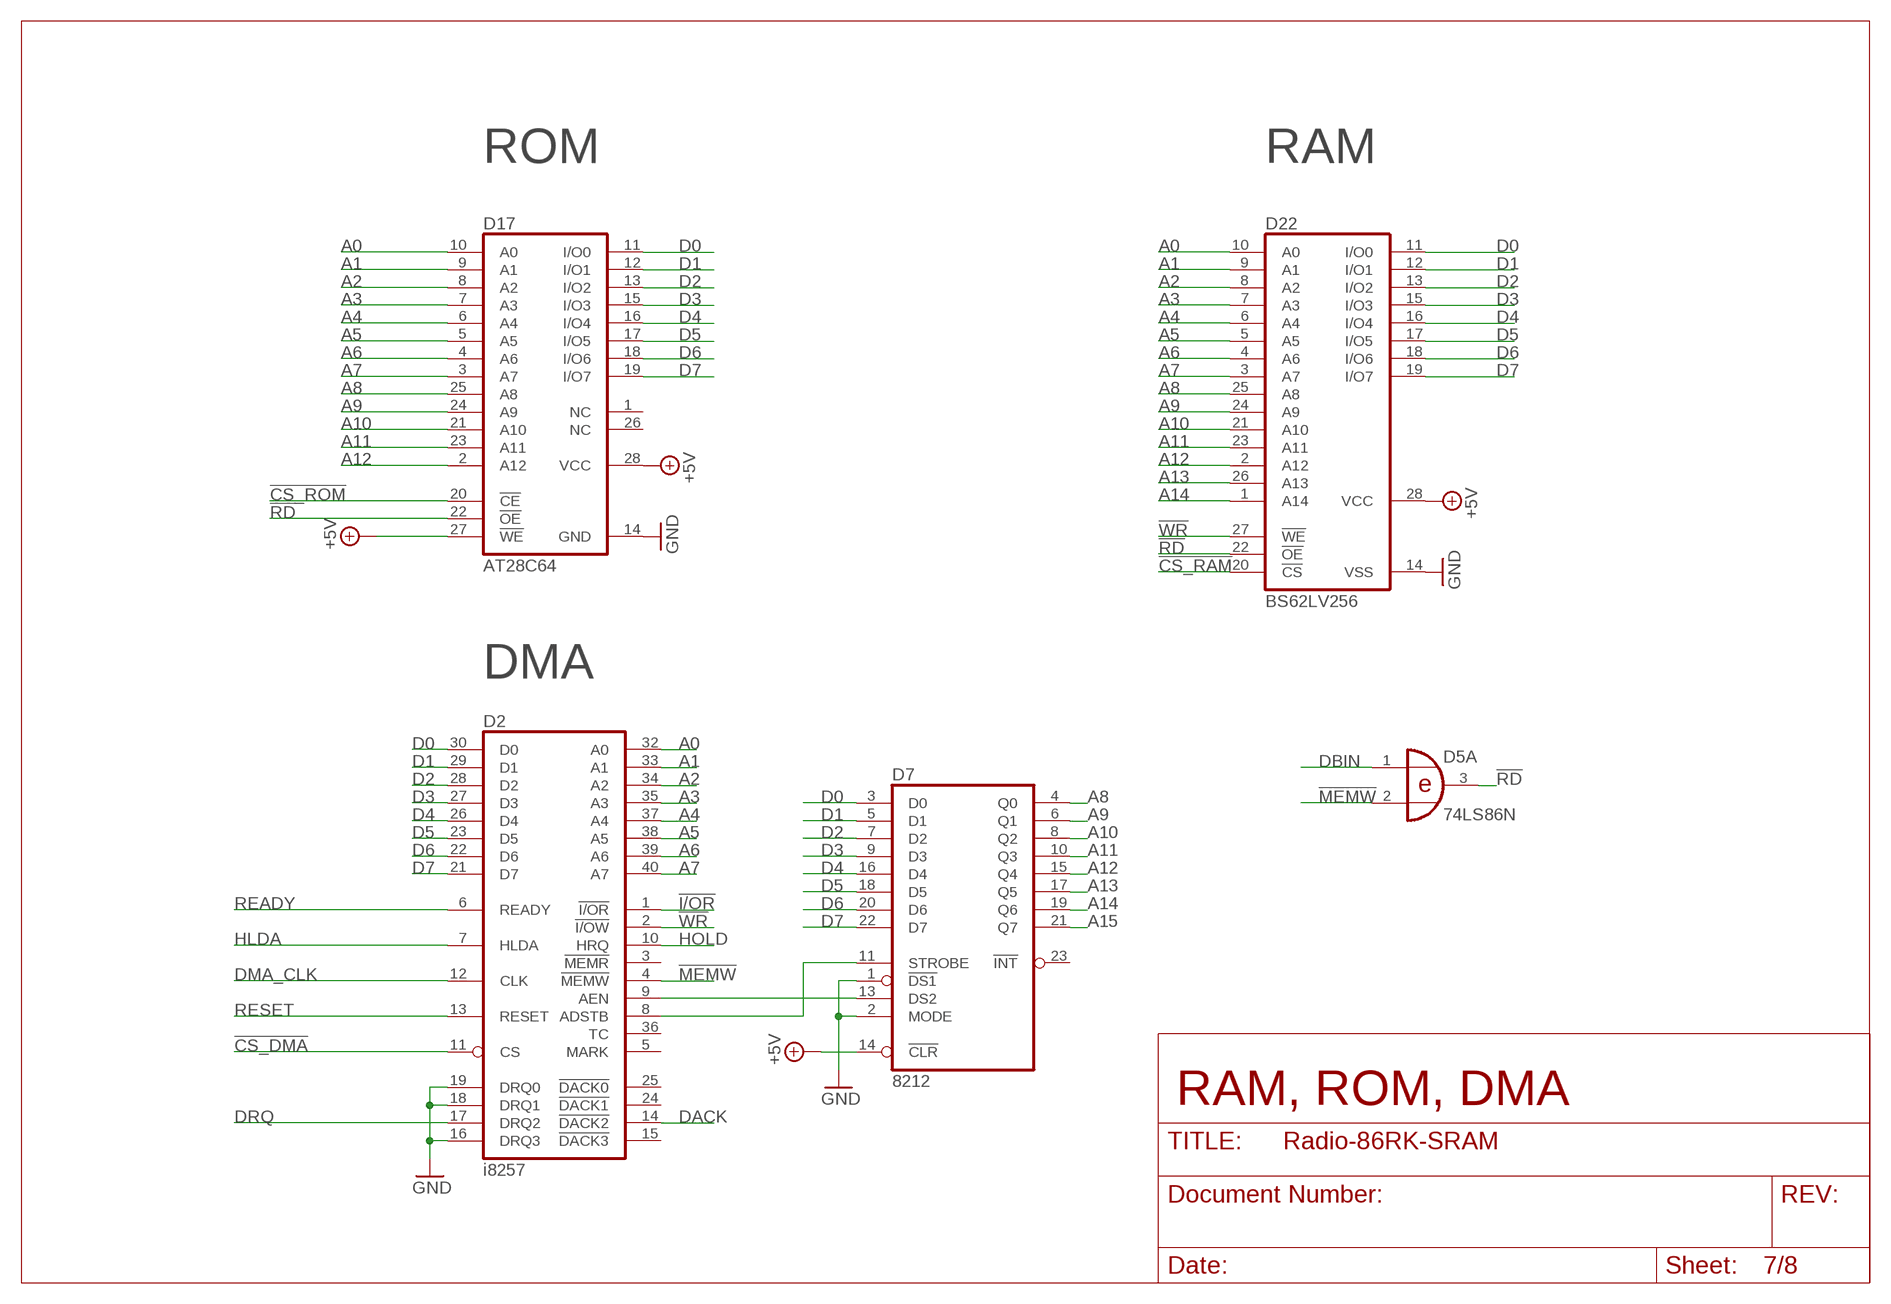
[diagram p6: schematic, sheet 7]

### Parts
D17  AT28C64  28C64C  [DIL28-6]
D22  BS62LV256  62256P  [DIL28-6]

### Nets
!CS_DMA: D2.11(CS) ; also sheet 8
!CS_RAM: D22.20(!CS) ; also sheet 8
!CS_ROM: D17.20(!CE) ; also sheet 8
!I/OR: D2.1(!I/OR) ; also sheet 3,8
!MEMW: D2.4(!MEMW) D5.2(A:I1) ; also sheet 8
!RD: D5.3(A:O) D17.22(!OE) D22.22(!OE) ; also sheet 3,4
!WR: D2.2(!I/OW) D22.27(!WE) ; also sheet 2,3,4
+5V [power]: D7.14(!CLR) D17.27(!WE) D17.28(VCC) D22.28(VCC) ; also sheet 2,3,4,5,6,8
A0: D2.32(A0) D17.10(A0) D22.10(A0) ; also sheet 2,3,4
A1: D2.33(A1) D17.9(A1) D22.9(A1) ; also sheet 2,4
A2: D2.34(A2) D17.8(A2) D22.8(A2) ; also sheet 2
A3: D2.35(A3) D17.7(A3) D22.7(A3) ; also sheet 2
A4: D2.37(A4) D17.6(A4) D22.6(A4) ; also sheet 2
A5: D2.38(A5) D17.5(A5) D22.5(A5) ; also sheet 2
A6: D2.39(A6) D17.4(A6) D22.4(A6) ; also sheet 2
A7: D2.40(A7) D17.3(A7) D22.3(A7) ; also sheet 2
A8: D7.4(Q0) D17.25(A8) D22.25(A8) ; also sheet 2
A9: D7.6(Q1) D17.24(A9) D22.24(A9) ; also sheet 2
A10: D7.8(Q2) D17.21(A10) D22.21(A10) ; also sheet 2
A11: D7.10(Q3) D17.23(A11) D22.23(A11) ; also sheet 2
A12: D7.15(Q4) D17.2(A12) D22.2(A12) ; also sheet 2,8
A13: D7.17(Q5) D22.26(A13) ; also sheet 2,8
A14: D7.19(Q6) D22.1(A14) ; also sheet 2,8
A15: D7.21(Q7) ; also sheet 2,8
D0: D2.30(D0) D7.3(D0) D17.11(I/O0) D22.11(I/O0) ; also sheet 2,3,4
D1: D2.29(D1) D7.5(D1) D17.12(I/O1) D22.12(I/O1) ; also sheet 2,3,4
D2: D2.28(D2) D7.7(D2) D17.13(I/O2) D22.13(I/O2) ; also sheet 2,3,4
D3: D2.27(D3) D7.9(D3) D17.15(I/O3) D22.15(I/O3) ; also sheet 2,3,4
D4: D2.26(D4) D7.16(D4) D17.16(I/O4) D22.16(I/O4) ; also sheet 2,3,4
D5: D2.23(D5) D7.18(D5) D17.17(I/O5) D22.17(I/O5) ; also sheet 2,3,4
D6: D2.22(D6) D7.20(D6) D17.18(I/O6) D22.18(I/O6) ; also sheet 2,3,4
D7: D2.21(D7) D7.22(D7) D17.19(I/O7) D22.19(I/O7) ; also sheet 2,3,4
DACK: D2.14(!DACK2) ; also sheet 3
DBIN: D5.1(A:I0) ; also sheet 2,8
DMA_CLK: D2.12(CLK) ; also sheet 2
DRQ: D2.17(DRQ2) ; also sheet 3
GND [power]: D2.16(DRQ3) D2.18(DRQ1) D2.19(DRQ0) D7.1(!DS1) D7.2(MODE) D17.14(GND) D22.14(VSS) ; also sheet 2,3,4,5,6,8
HLDA: D2.7(HLDA) ; also sheet 2
HOLD: D2.10(HRQ) ; also sheet 2
N$9: D2.8(ADSTB) D7.11(STROBE)
N$14: D2.9(AEN) D7.13(DS2)
READY: D2.6(READY) ; also sheet 2
RESET: D2.13(RESET) ; also sheet 2,4,8
Unconnected: D2.3(!MEMR) D2.5(MARK) D2.15(!DACK3) D2.24(!DACK1) D2.25(!DACK0) D2.36(TC) D7.23(!INT) D17.1(NC) D17.26(NC)

### Notes on the sheet
- ROM | RAM
- DMA
- RAM, ROM, DMA

## Sheet 8 of 8
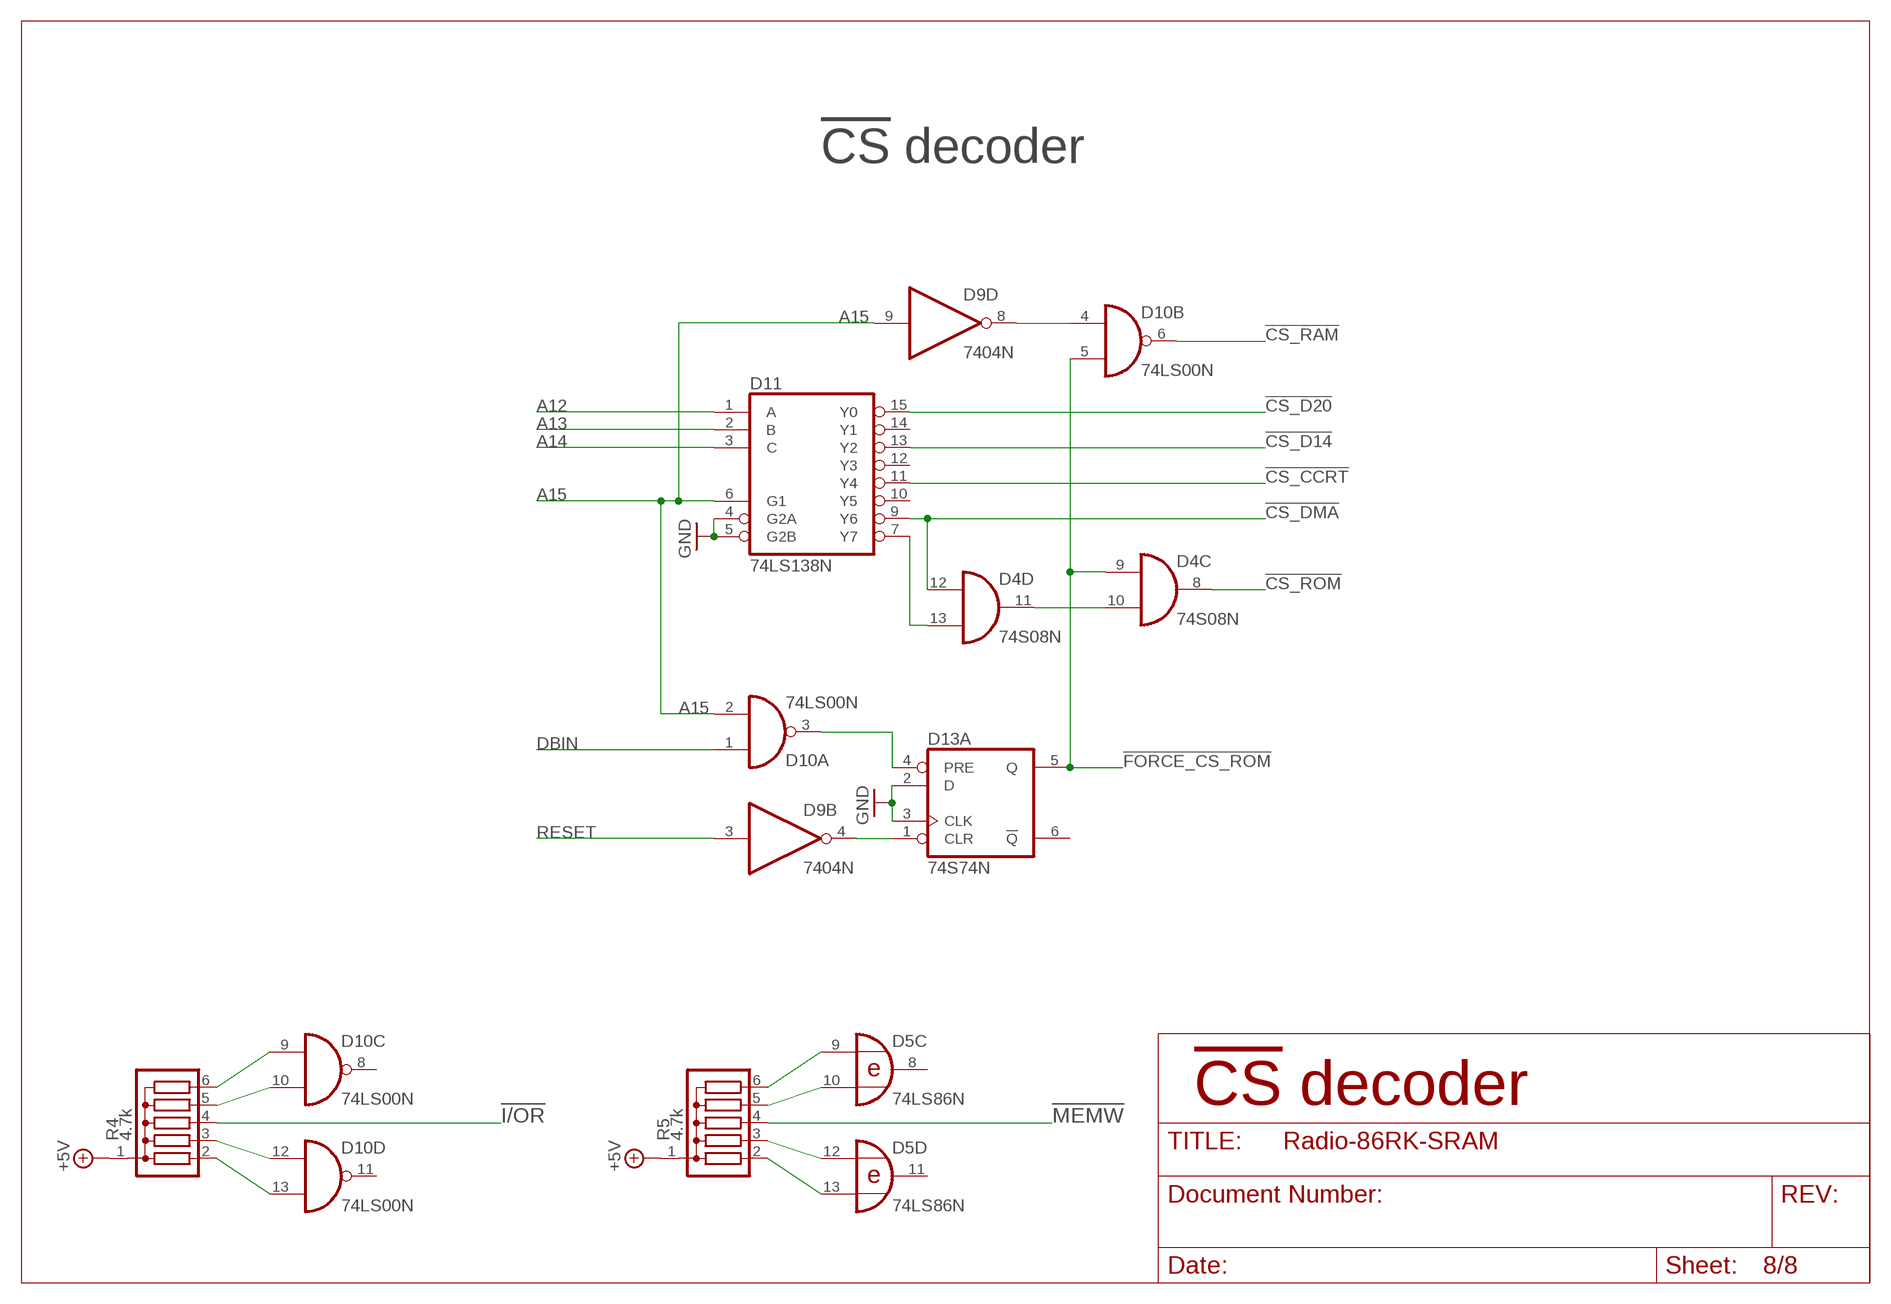
[diagram p7: schematic, sheet 8]

### Parts
R4  4.7k  G05R  [SIL6]
R5  4.7k  G05R  [SIL6]

### Nets
!CS_CCRT: D11.11(Y4) ; also sheet 3
!CS_D14: D11.13(Y2) ; also sheet 4
!CS_D20: D11.15(Y0) ; also sheet 4
!CS_DMA: D4.12(D:I0) D11.9(Y6) ; also sheet 7
!CS_F000: D4.13(D:I1) D11.7(Y7)
!CS_RAM: D10.6(B:O) ; also sheet 7
!CS_ROM: D4.8(C:O) ; also sheet 7
!FORCE_CS_ROM: D4.9(C:I0) D10.5(B:I1) D13.5(A:Q)
!I/OR: R4.4 ; also sheet 3,7
!MEMW: R5.4 ; also sheet 7
+5V [power]: R4.1 R5.1 ; also sheet 2,3,4,5,6,7
A12: D11.1(A) ; also sheet 2,7
A13: D11.2(B) ; also sheet 2,7
A14: D11.3(C) ; also sheet 2,7
A15: D9.9(D:I) D10.2(A:I1) D11.6(G1) ; also sheet 2,7
DBIN: D10.1(A:I0) ; also sheet 2,7
GND [power]: D11.4(G2A) D11.5(G2B) D13.2(A:D) D13.3(A:CLK) ; also sheet 2,3,4,5,6,7
N$6: D10.3(A:O) D13.4(A:PRE)
N$8: D9.4(B:O) D13.1(A:CLR)
N$13: D4.10(C:I1) D4.11(D:O)
N$19: D9.8(D:O) D10.4(B:I0)
N$20: D10.13(D:I1) R4.2
N$21: D10.12(D:I0) R4.3
N$22: D10.10(C:I1) R4.5
N$24: D10.9(C:I0) R4.6
N$25: D5.13(D:I1) R5.2
N$26: D5.12(D:I0) R5.3
N$29: D5.10(C:I1) R5.5
N$61: D5.9(C:I0) R5.6
RESET: D9.3(B:I) ; also sheet 2,4,7
Unconnected: D5.8(C:O) D5.11(D:O) D10.8(C:O) D10.11(D:O) D11.10(Y5) D11.12(Y3) D11.14(Y1) D13.6(A:!Q)

### Notes on the sheet
- !CS! decoder
- !CS! decoder

## Power pins joined to a net without a drawn wire
GND: DIN1.G1(GND) DIN1.G2(GND) DIN1.G3(GND)

## Library data of the parts
24V_IN = con-jack:DCJ0202: DC POWER JACK Source: DCJ0202.pdf; OC_FARNELL: unknown; OC_NEWARK: unknown
+5V +12V -5V LED = led:LED: LED OSRAM: - CHIPLED LG R971, LG N971, LY N971, LG Q971, LY Q971, LO R971, LY R971 LH N974, LH R974 LS Q976, LO Q976, LY Q976 LO Q996 - Hyper CHIPLED LW Q18S LB Q993, LB Q99A, LB R99A - SideLED LS A670, LO A670, LY A670, LG A670, LP A670 LB A673, LV A673, LT A673, LW A673 LH A674 LY A675 LS A676, LA A676, LO A676, LY A676, LW A676 LS A679, LY A679, LG A679 - Hyper Micro SIDELED® LS Y876, LA Y876, LO Y876, LY Y876 LT Y87S - SmartLED LW L88C, LW L88S LB L89C, LB L89S, LG L890 LS L89K, LO L89K, LY L89K LS L896, LA L896, LO L896, LY L896 - TOPLED LS T670, LO T670, LY T670, LG T670, LP T670 LSG T670, LSP T670, LSY T670, LOP T670, LYG T670 LG T671, LOG T671, LSG T671 LB T673, LV T673, LT T673, LW T673 LH T674 LS T676, LA T676, LO T676, LY T676, LB T676, LH T676, LSB T676, LW T676 LB T67C, LV T67C, LT T67C, LS T67K, LO T67K, LY T67K, LW E67C LS E67B, LA E67B, LO E67B, LY E67B, LB E67C, LV E67C, LT E67C LW T67C LS T679, LY T679, LG T679 LS T770, LO T770, LY T770, LG T770, LP T770 LB T773, LV T773, LT T773, LW T773 LH T774 LS E675, LA E675, LY E675, LS T675 LS T776, LA T776, LO T776, LY T776, LB T776 LHGB T686 LT T68C, LB T68C - Hyper Mini TOPLED® LB M676 - Mini TOPLED Santana® LG M470 LS M47K, LO M47K, LY M47K Source: http://www.osram.convergy.de LUXEON: - LUMILED® LXK2-PW12-R00, LXK2-PW12-S00, LXK2-PW14-U00, LXK2-PW14-V00 LXK2-PM12-R00, LXK2-PM12-S00, LXK2-PM14-U00 LXK2-PE12-Q00, LXK2-PE12-R00, LXK2-PE12-S00, LXK2-PE14-T00, LXK2-PE14-U00 LXK2-PB12-K00, LXK2-PB12-L00, LXK2-PB12-M00, LXK2-PB14-N00, LXK2-PB14-P00, LXK2-PB14-Q00 LXK2-PR12-L00, LXK2-PR12-M00, LXK2-PR14-Q00, LXK2-PR14-R00 LXK2-PD12-Q00, LXK2-PD12-R00, LXK2-PD12-S00 LXK2-PH12-R00, LXK2-PH12-S00 LXK2-PL12-P00, LXK2-PL12-Q00, LXK2-PL12-R00 Source: www.luxeon.com KINGBRIGHT: KA-3528ASYC Source: www.kingbright.com
C2 C4-C12 C17-C25 C101-C114 = rcl:C-EU: CAPACITOR, European symbol
C3 C115 C116 = rcl:CPOL-EU: POLARIZED CAPACITOR, European symbol
D1 = micro-intel:8224: MICROCOMPUTER/PERIPHERAL DEVICE; OC_FARNELL: unknown; OC_NEWARK: unknown
D2 = 8080:8257: Programmable DMA controller
D3 = 74xx-eu:74*92: Decade, divide by twelve and binary COUNTER
D4 = 74xx-eu:74*08: Quad 2-input AND gate
D5 = 74xx-eu:74*86: Quad 2-input EXCLUSIVE-OR (XOR) gate
D6 = micro-intel:8080: MICROCOMPUTER/PERIPHERAL DEVICE; OC_FARNELL: unknown; OC_NEWARK: unknown
D7 = 8080:8212: 8-bit Input/Output Port
D8 = 8080:8275: Programmable CRT Controller
D9 = 74xx-us:74*04: Hex INVERTER
D10 = 74xx-eu:74*00: Quad 2-input NAND gate
D11 = 74xx-eu:74*138: 3-line to 8-line DECODER/DEMULTIPLEXER
D12 = memory:2816: MEMORY
D13 = 74xx-us:74*74: Dual D type positive edge triggered FLIP FLOP, preset and clear
D14 D20 = 8080:8255A: MICROCOMPUTER/PERIPHERAL DEVICE; OC_FARNELL: unknown; OC_NEWARK: unknown
D15 = 74xx-us:74*198: 8-bit SHIFT REGISTER
D17 = memory-nec:28C64C: MEMORY; MPN: AT28C64B-15PU; OC_FARNELL: 1095784; OC_NEWARK: 96K6557
D21 D32 = linear:1AMP_P7+4: OP AMP
D22 = memory-hitachi:62256P: MEMORY; OC_FARNELL: unknown; OC_NEWARK: unknown
D30 = atmel:MEGA8-P: MICROCONTROLLER 8 Kbytes FLASH, 1 kbytes SRAM, 512 bytes EEPROM, USART, 4-channel 10 bit ADC, 2-channel 8 bit ADC Pin compatible with Atmega48, ATMega88, ATMega168 Source: avr.lbr; OC_FARNELL: unknown; OC_NEWARK: unknown
D31 = memory-hitachi:58C256P: MEMORY; MPN: HN58C256AP85E; OC_FARNELL: 1496447; OC_NEWARK: 61M6616
D33 = XP_Power:IW_S
D34 D35 = XP_Power:JTF_S: XP Power JTF Series Single Output DC/DC convertor
DIN1 = MiniDIN:TM0508A/6: PIN HEADER
EXT_RST = pinhead:PINHD-1X2: PIN HEADER
F1 = fuse:TE5: FUSE Wickmann; OC_FARNELL: unknown; OC_NEWARK: unknown
H1 = buzzer:EFB?: Piezoelectric Acoustic Transducer Source: Panbasonic .. 2SC1685.pdf; OC_FARNELL: unknown; OC_NEWARK: unknown
ISP = pinhead:PINHD-2X3: PIN HEADER
P14 P20 = con-3m:2526-: 3M (TM) Pak 100 4-Wall Header Source: 3M; OC_FARNELL: 9838392; OC_NEWARK: unknown
PIXEL_CLK = crystal:QG5460: CRYSTAL RESONATOR; OC_FARNELL: unknown; OC_NEWARK: unknown
R1 R3 R15-R19 R29-R33 R101 R103 R107-R111 = rcl:R-EU_: RESISTOR, European symbol
R4 R5 R104 = resistor-sil:G05R: SIL RESISTOR; OC_FARNELL: unknown; OC_NEWARK: unknown
R6-R12 = resistor-sil:G07R: SIL RESISTOR; OC_FARNELL: unknown; OC_NEWARK: unknown
RESET = switch-omron:10-XX: OMRON SWITCH; MPN: B3F-1000; OC_FARNELL: 176432; OC_NEWARK: 36M3542
TAPE_IN TAPE_OUT VIDEO_OUT = con-lumberg:WBTOR1: RCA connectors according to JEITA RC-5231 Cinch RCA-Einbaukupplung nach JEITA RC-5231, abgewinkelte Ausführung Source: http://www.lumberg.de/Produkte/PDFs/WBTOR1.pdf; MPN: WBTOR 1 BLACK; OC_FARNELL: 1200146; OC_NEWARK: 98K2588
TVS1 = diode:DIODE-: DIODE
VD1 VD3 VD101 = diode:1N4148: DIODE high speed (Philips)
VT2 = transistor:2N3904: NPN TRANSISTOR
Z1 = crystal:CRYSTAL: CRYSTAL; OC_FARNELL: 1666969; OC_NEWARK: unknown

## Net classes
0 default: width 0.305 mm, clearance 0.305 mm
1 power: width 1.016 mm, clearance 0.305 mm